# EAGLE design rapidshark-lipo-sensor-mk-3.5 (EAGLE 7.5.0)
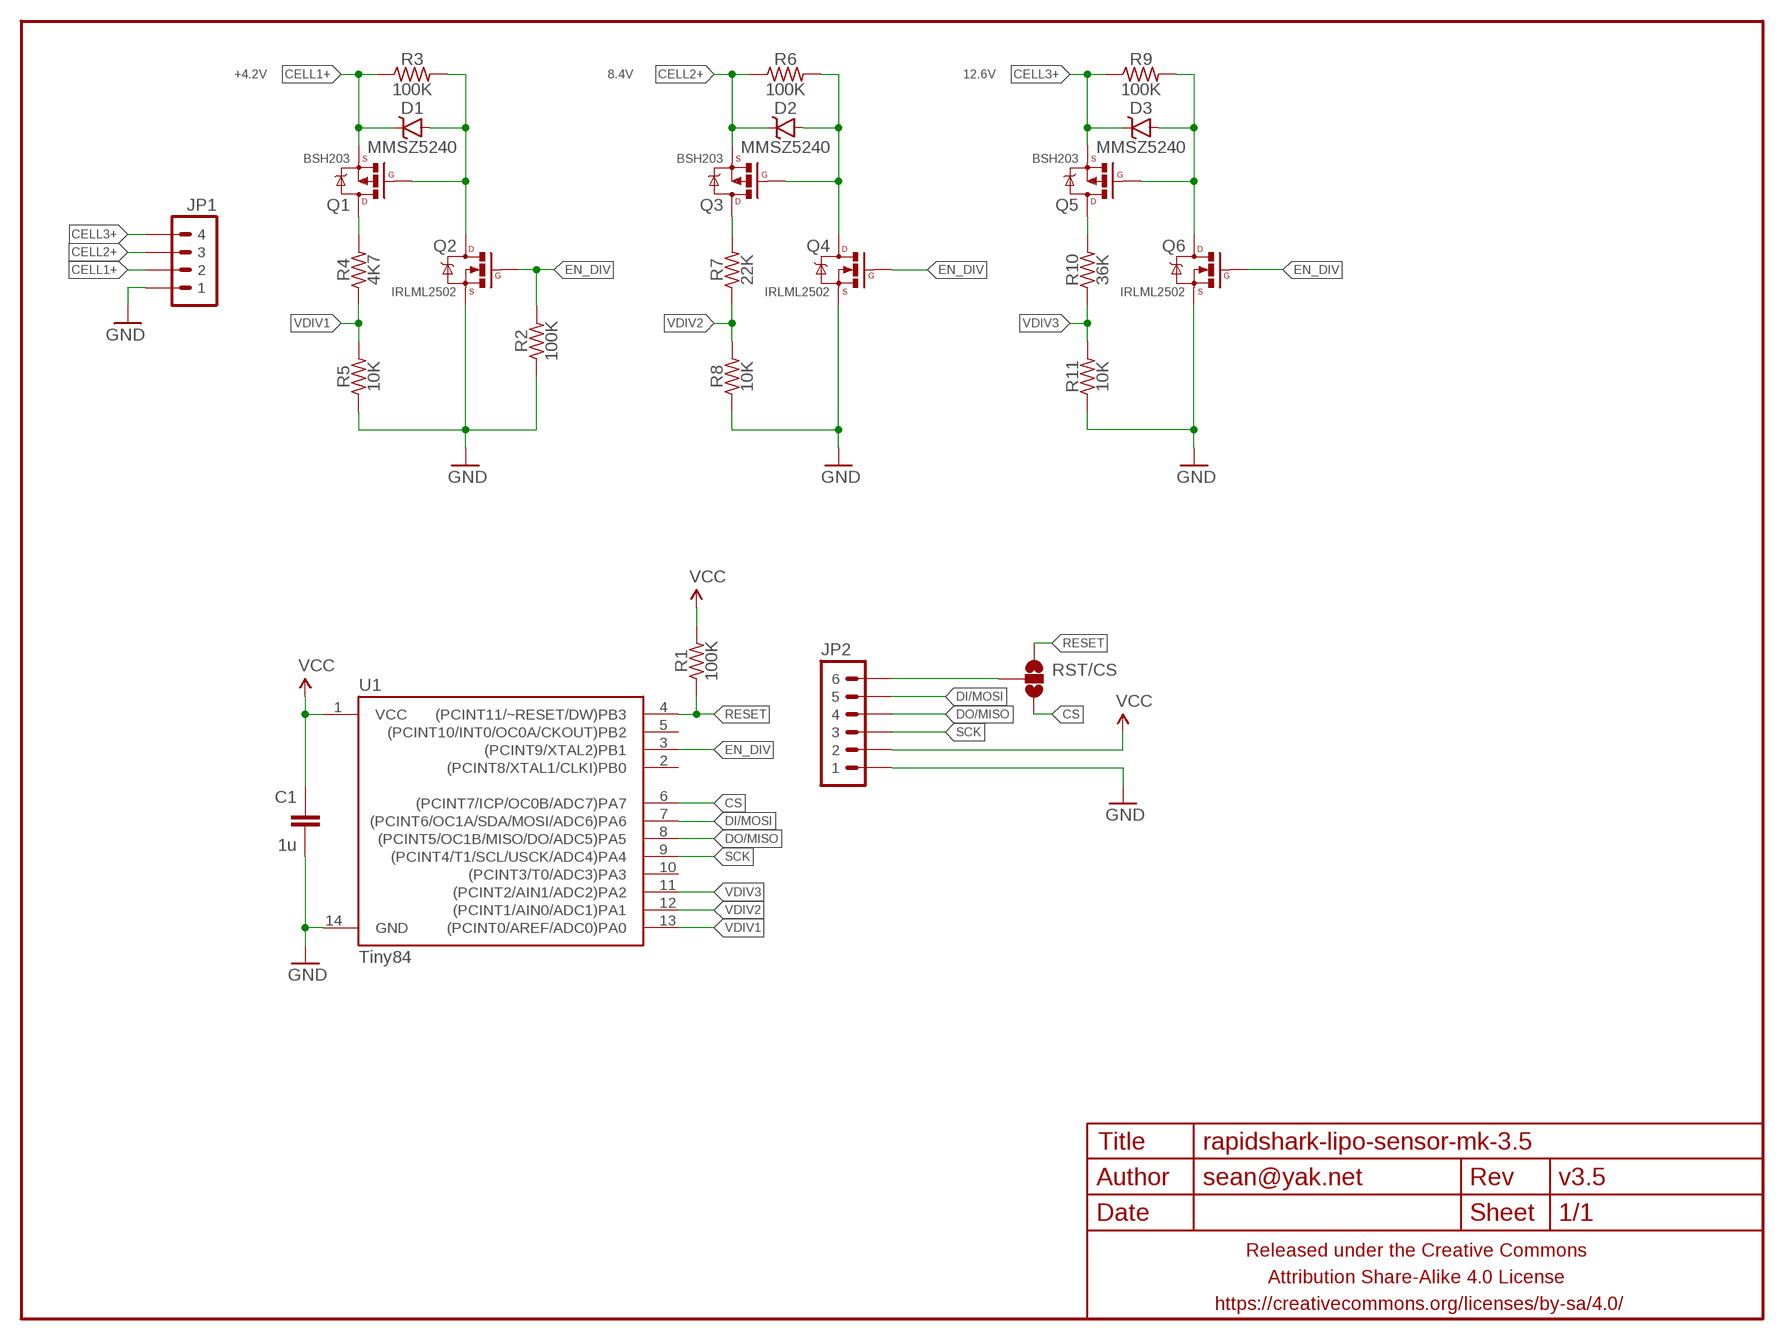
[diagram p0: schematic, sheet 1]

## Parts
C1  1u  CAPACITOR-CERAMICC0603-TIGHTER  [C0603-TIGHTER]
D1  MMSZ5240  DIODE-ZENERSOD323  [SOD323-ZENNER]
D2  MMSZ5240  DIODE-ZENERSOD323  [SOD323-ZENNER]
D3  MMSZ5240  DIODE-ZENERSOD323  [SOD323-ZENNER]
FRAME1  FRAME-LETTERNO_PACKAGE  [DUMMY]
JP1  M04JST_XH_RA  [JST-4-XH-RA-PTH]
JP2  M06PTH_CENTERED  [1X06_CENTERED]
Q1  BSH203  MOSFET-PCHANNELSOT-23  [SOT23]
Q2  IRLML2502  MOSFET-NCHANNELIRLML2502  [SOT23]
Q3  BSH203  MOSFET-PCHANNELSOT-23  [SOT23]
Q4  IRLML2502  MOSFET-NCHANNELIRLML2502  [SOT23]
Q5  BSH203  MOSFET-PCHANNELSOT-23  [SOT23]
Q6  IRLML2502  MOSFET-NCHANNELIRLML2502  [SOT23]
R1  100K  RESISTORR0603-TIGHTER  [R0603-TIGHTER]
R2  100K  RESISTORR0603-TIGHTER  [R0603-TIGHTER]
R3  100K  RESISTORR0603-TIGHTER  [R0603-TIGHTER]
R4  4K7  RESISTORR0603-TIGHTER  [R0603-TIGHTER]
R5  10K  RESISTORR0603-TIGHTER  [R0603-TIGHTER]
R6  100K  RESISTORR0603-TIGHTER  [R0603-TIGHTER]
R7  22K  RESISTORR0603-TIGHTER  [R0603-TIGHTER]
R8  10K  RESISTORR0603-TIGHTER  [R0603-TIGHTER]
R9  100K  RESISTORR0603-TIGHTER  [R0603-TIGHTER]
R10  36K  RESISTORR0603-TIGHTER  [R0603-TIGHTER]
R11  10K  RESISTORR0603-TIGHTER  [R0603-TIGHTER]
RST/CS  JUMPER-PAD-3-NOFULL_BOX_SILK  [PAD-JUMPER-3-NO_YES_SILK_FULL_BOX]
U1  Tiny84  ATTINY84  [SO14]

## Nets
CELL1+: D1.C JP1.2 Q1.2(S) R3.1
CELL2+: D2.C JP1.3 Q3.2(S) R6.1
CELL3+: D3.C JP1.4 Q5.2(S) R9.1
CS: RST/CS.3 U1.6((PCINT7/ICP/OC0B/ADC7)PA7)
DI/MOSI: JP2.5 U1.7((PCINT6/OC1A/SDA/MOSI/ADC6)PA6)
DO/MISO: JP2.4 U1.8((PCINT5/OC1B/MISO/DO/ADC5)PA5)
EN_DIV: Q2.1(G) Q4.1(G) Q6.1(G) R2.2 U1.3((PCINT9/XTAL2)PB1)
GND: C1.2 JP1.1 JP2.1 Q2.2(S) Q4.2(S) Q6.2(S) R2.1 R5.1 R8.1 R11.1 U1.14(GND)
N$2: Q3.3(D) R7.2
N$3: Q5.3(D) R10.2
N$4: D1.A Q1.1(G) Q2.3(D) R3.2
N$5: D2.A Q3.1(G) Q4.3(D) R6.2
N$6: Q1.3(D) R4.2
N$7: D3.A Q5.1(G) Q6.3(D) R9.2
RESET: R1.1 RST/CS.1 U1.4((PCINT11/~RESET/DW)PB3)
RST/CS: JP2.6 RST/CS.2
SCK: JP2.3 U1.9((PCINT4/T1/SCL/USCK/ADC4)PA4)
VCC: C1.1 JP2.2 R1.2 U1.1(VCC)
VDIV1: R4.1 R5.2 U1.13((PCINT0/AREF/ADC0)PA0)
VDIV2: R7.1 R8.2 U1.12((PCINT1/AIN0/ADC1)PA1)
VDIV3: R10.1 R11.2 U1.11((PCINT2/AIN1/ADC2)PA2)
Unconnected: U1.2((PCINT8/XTAL1/CLKI)PB0) U1.5((PCINT10/INT0/OC0A/CKOUT)PB2) U1.10((PCINT3/T0/ADC3)PA3)

## Notes on the sheet
- +4.2V | 8.4V | 12.6V

## Library data of the parts
C1 = a_parts:CAPACITOR-CERAMIC: CAPACITOR, European symbol
D1-D3 = a_parts:DIODE-ZENER: Zener Diode Production Part - 8199 3.4V Zener Voltage
FRAME1 = A_butts:FRAME-LETTER: Schematic Frame Standard 8.5x11 US Letter frame; DESIGNER: sean@yak.net; VERSION: v3.5
JP1 = a_parts:M04: Header 4 Standard 4-pin 0.1" header. Use with straight break away headers (SKU : PRT-00116), right angle break away headers (PRT-00553), swiss pins (PRT-00743), machine pins (PRT-00117), and female headers (PRT-00115). Molex polarized connector foot print use with SKU : PRT-08231 with associated crimp pins and housings. 1MM SMD Version SKU: PRT-10208
JP2 = a_parts:M06: Header 6 Standard 6-pin 0.1" header. Use with straight break away headers (SKU : PRT-00116), right angle break away headers (PRT-00553), swiss pins (PRT-00743), machine pins (PRT-00117), and female headers (PRT-00115). Molex polarized connector foot print use with SKU : PRT-08094 with associated crimp pins and housings. NOTES ON THE VARIANTS LOCK and LOCK_LONGPADS... This footprint was designed to help hold the alignment of a through-hole component (i.e. 6-pin header) while soldering it into place. You may notice that each hole has been shifted either up or down by 0.005 of an inch from it's more standard position (which is a perfectly straight line). This slight alteration caused the pins (the squares in the middle) to touch the edges of the holes. Because they are alternating, it causes a "brace" to hold the component in place. 0.005 has proven to be the perfect amount of "off-center" position when using our standard breakaway headers. Although looks a little odd when you look at the bare footprint, once you have a header in there, the alteration is very hard to notice. Also,if you push a header all the way into place, it is covered up entirely on the bottom side. This idea of altering the position of holes to aid alignment will be further integrated into the Sparkfun Library for other footprints. It can help hold any component with 3 or more connection pins.
Q1 Q3 Q5 = a_parts:MOSFET-PCHANNEL: Generic PMOSFET IRLML2244 - TRANS-11153 (SOT-23 -20V -4.3A) (1.Gate 2.Source 3.Drain) FQP27P06 - COM-10349 <http://www.sparkfun.com/products/10349> (TO-220 -60V -27A) (1.Gate 2.Source 3.Drain)
Q2 Q4 Q6 = a_parts:MOSFET-NCHANNEL: Common NMOSFET Parts MFG P/N Store ID Prod ID FDD8780 TRANS-09984 SI7820DN TRANS-11055 FDS6630A IC-08089 2N7002PW TRANS-11151 FQP30N06L COM-10213 TRANS-10060 BSS123LT1G TRANS-08345 BSS138 TRANS-00830 BS170 2N7000
R1-R11 = a_parts:RESISTOR: RESISTOR, American symbol
RST/CS = a_parts:JUMPER-PAD-3-NO
U1 = A_butts:ATTINY84: Atmel 14-pin 2/4/8kB flash uC

## Board
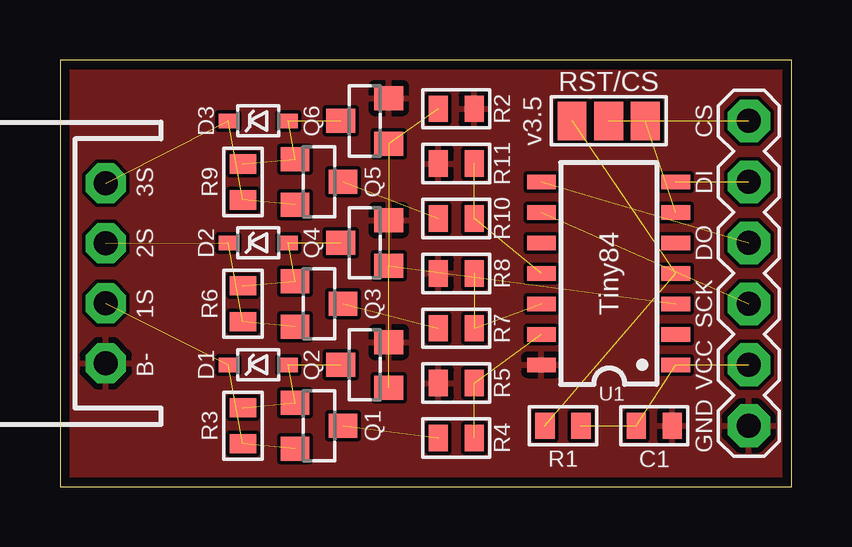
[diagram p1: board, top side]
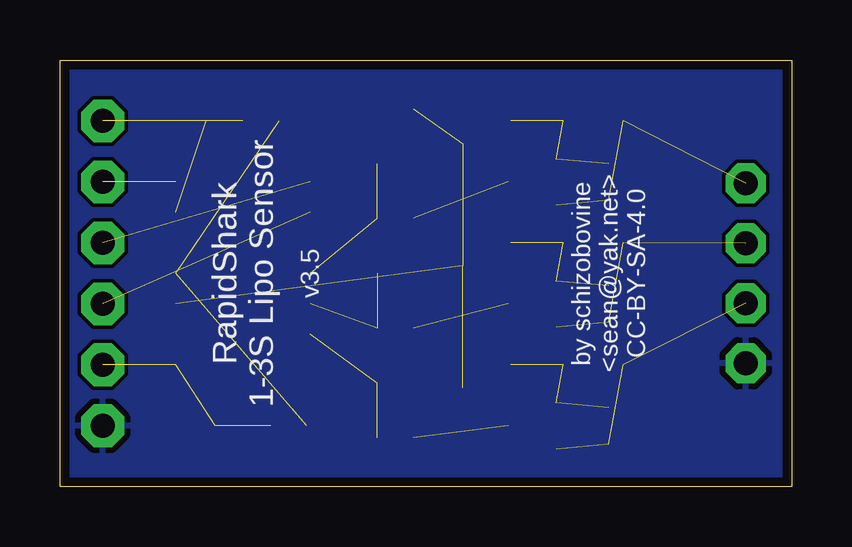
[diagram p2: board, bottom side, seen from below]

Size 30.48 x 17.78 mm. Coordinates in mm from the lower left corner, seen from the top.
Outline: 0,0 30.48,0 30.48,17.78 0,17.78 0,0
Copper layers (1*16): Top 0.0356mm / dielectric 1.5011mm / Bottom 0.0356mm
Design rules "LaenPCBOrder2": minimum track width 6mil, minimum drill 13mil, track to track 6mil, track to pad 6mil, pad to pad 6mil, via to via 6mil, smd to smd 6mil, copper to edge 15mil, drill to drill 6mil, minimum pad ring 7mil, minimum via ring 7mil, stop-mask expansion 3mil, vias tented up to drill 20mil, thermal gap 10mil

### Footprints (pad centres in the part's own frame; a part is rotated, then mirrored left to right if it is on the bottom)
C0603-TIGHTER = smd 0.8 x 1.1: 1 -0.75,0; 2 0.75,0
SOD323-ZENNER = smd 0.8 x 0.6: A -1.25,0; C 1.25,0; C1 1.25,0
JST-4-XH-RA-PTH = drill 1 pad 1.676 octagon: 1 -3.75,0; 2 -1.25,0; 3 1.25,0; 4 3.75,0
1X06_CENTERED = drill 1 pad 1.778 octagon: 1 -6.35,0; 2 -3.81,0; 3 -1.27,0; 4 1.27,0; 5 3.81,0; 6 6.35,0
SOT23 = smd 1 x 1.2: 1 -0.95,-1; 2 0.95,-1; 3 0,1
R0603-TIGHTER = smd 0.8 x 1.1: 1 -0.75,0; 2 0.75,0
PAD-JUMPER-3-NO_YES_SILK_FULL_BOX = smd 1.2 x 1.6: 1 -1.524,0; 2 0,0; 3 1.524,0
SO14 = smd 0.6 x 1.2: 1 -3.81,-2.8; 2 -2.54,-2.8; 3 -1.27,-2.8; 4 0,-2.8; 5 1.27,-2.8; 6 2.54,-2.8; 7 3.81,-2.8; 8 3.81,2.8; 9 2.54,2.8; 10 1.27,2.8; 11 0,2.8; 12 -1.27,2.8; 13 -2.54,2.8; 14 -3.81,2.8

### Placement (x,y rotation side)
C1  24.77,2.54 0 top
D1  8.26,5.08 180 top
D2  8.26,10.16 180 top
D3  8.26,15.24 180 top
FRAME1  0,0 0 top
JP1  1.91,8.89 90 top
JP2  28.7,8.89 90 top
Q1  10.79,2.54 270 top
Q2  12.7,5.08 90 top
Q3  10.79,7.62 270 top
Q4  12.7,10.16 90 top
Q5  10.79,12.7 270 top
Q6  12.7,15.24 90 top
R1  20.95,2.54 0 top
R2  16.51,15.75 180 top
R3  7.62,2.54 90 top
R4  16.51,2.03 180 top
R5  16.51,4.32 0 top
R6  7.62,7.62 90 top
R7  16.51,6.6 180 top
R8  16.51,8.89 0 top
R9  7.62,12.7 90 top
R10  16.51,11.18 180 top
R11  16.51,13.46 0 top
RST/CS  22.86,15.24 0 top
U1  22.86,8.89 90 top

### Tracks (layer width: path | path; a pad name or v marks a point on that pad's centre or on a via)
CELL1+  (3 unrouted)
CELL2+  (3 unrouted)
CELL3+  (3 unrouted)
CS  (1 unrouted)
DI/MOSI  (1 unrouted)
DO/MISO  (1 unrouted)
EN_DIV  (4 unrouted)
GND
  pour Bottom: 0,17.78 30.48,17.78 30.48,0 0,0
  pour Top: 0,17.78 30.48,17.78 30.48,0 0,0
N$2  (1 unrouted)
N$3  (1 unrouted)
N$4  (3 unrouted)
N$5  (3 unrouted)
N$6  (1 unrouted)
N$7  (3 unrouted)
RESET  (2 unrouted)
RST/CS  (1 unrouted)
SCK  (1 unrouted)
VCC  (3 unrouted)
VDIV1  (2 unrouted)
VDIV2  (2 unrouted)
VDIV3  (2 unrouted)

### Text on the board
tPlace: CS | 3S | DI | 2S | DO | 1S | SCK | B- | VCC | GND
bPlace: by schizobovine / <sean@yak.net> / CC-BY-SA-4.0 | RapidShark / 1-3S Lipo Sensor